# EAGLE schematic Master (EAGLE 6.5.0)
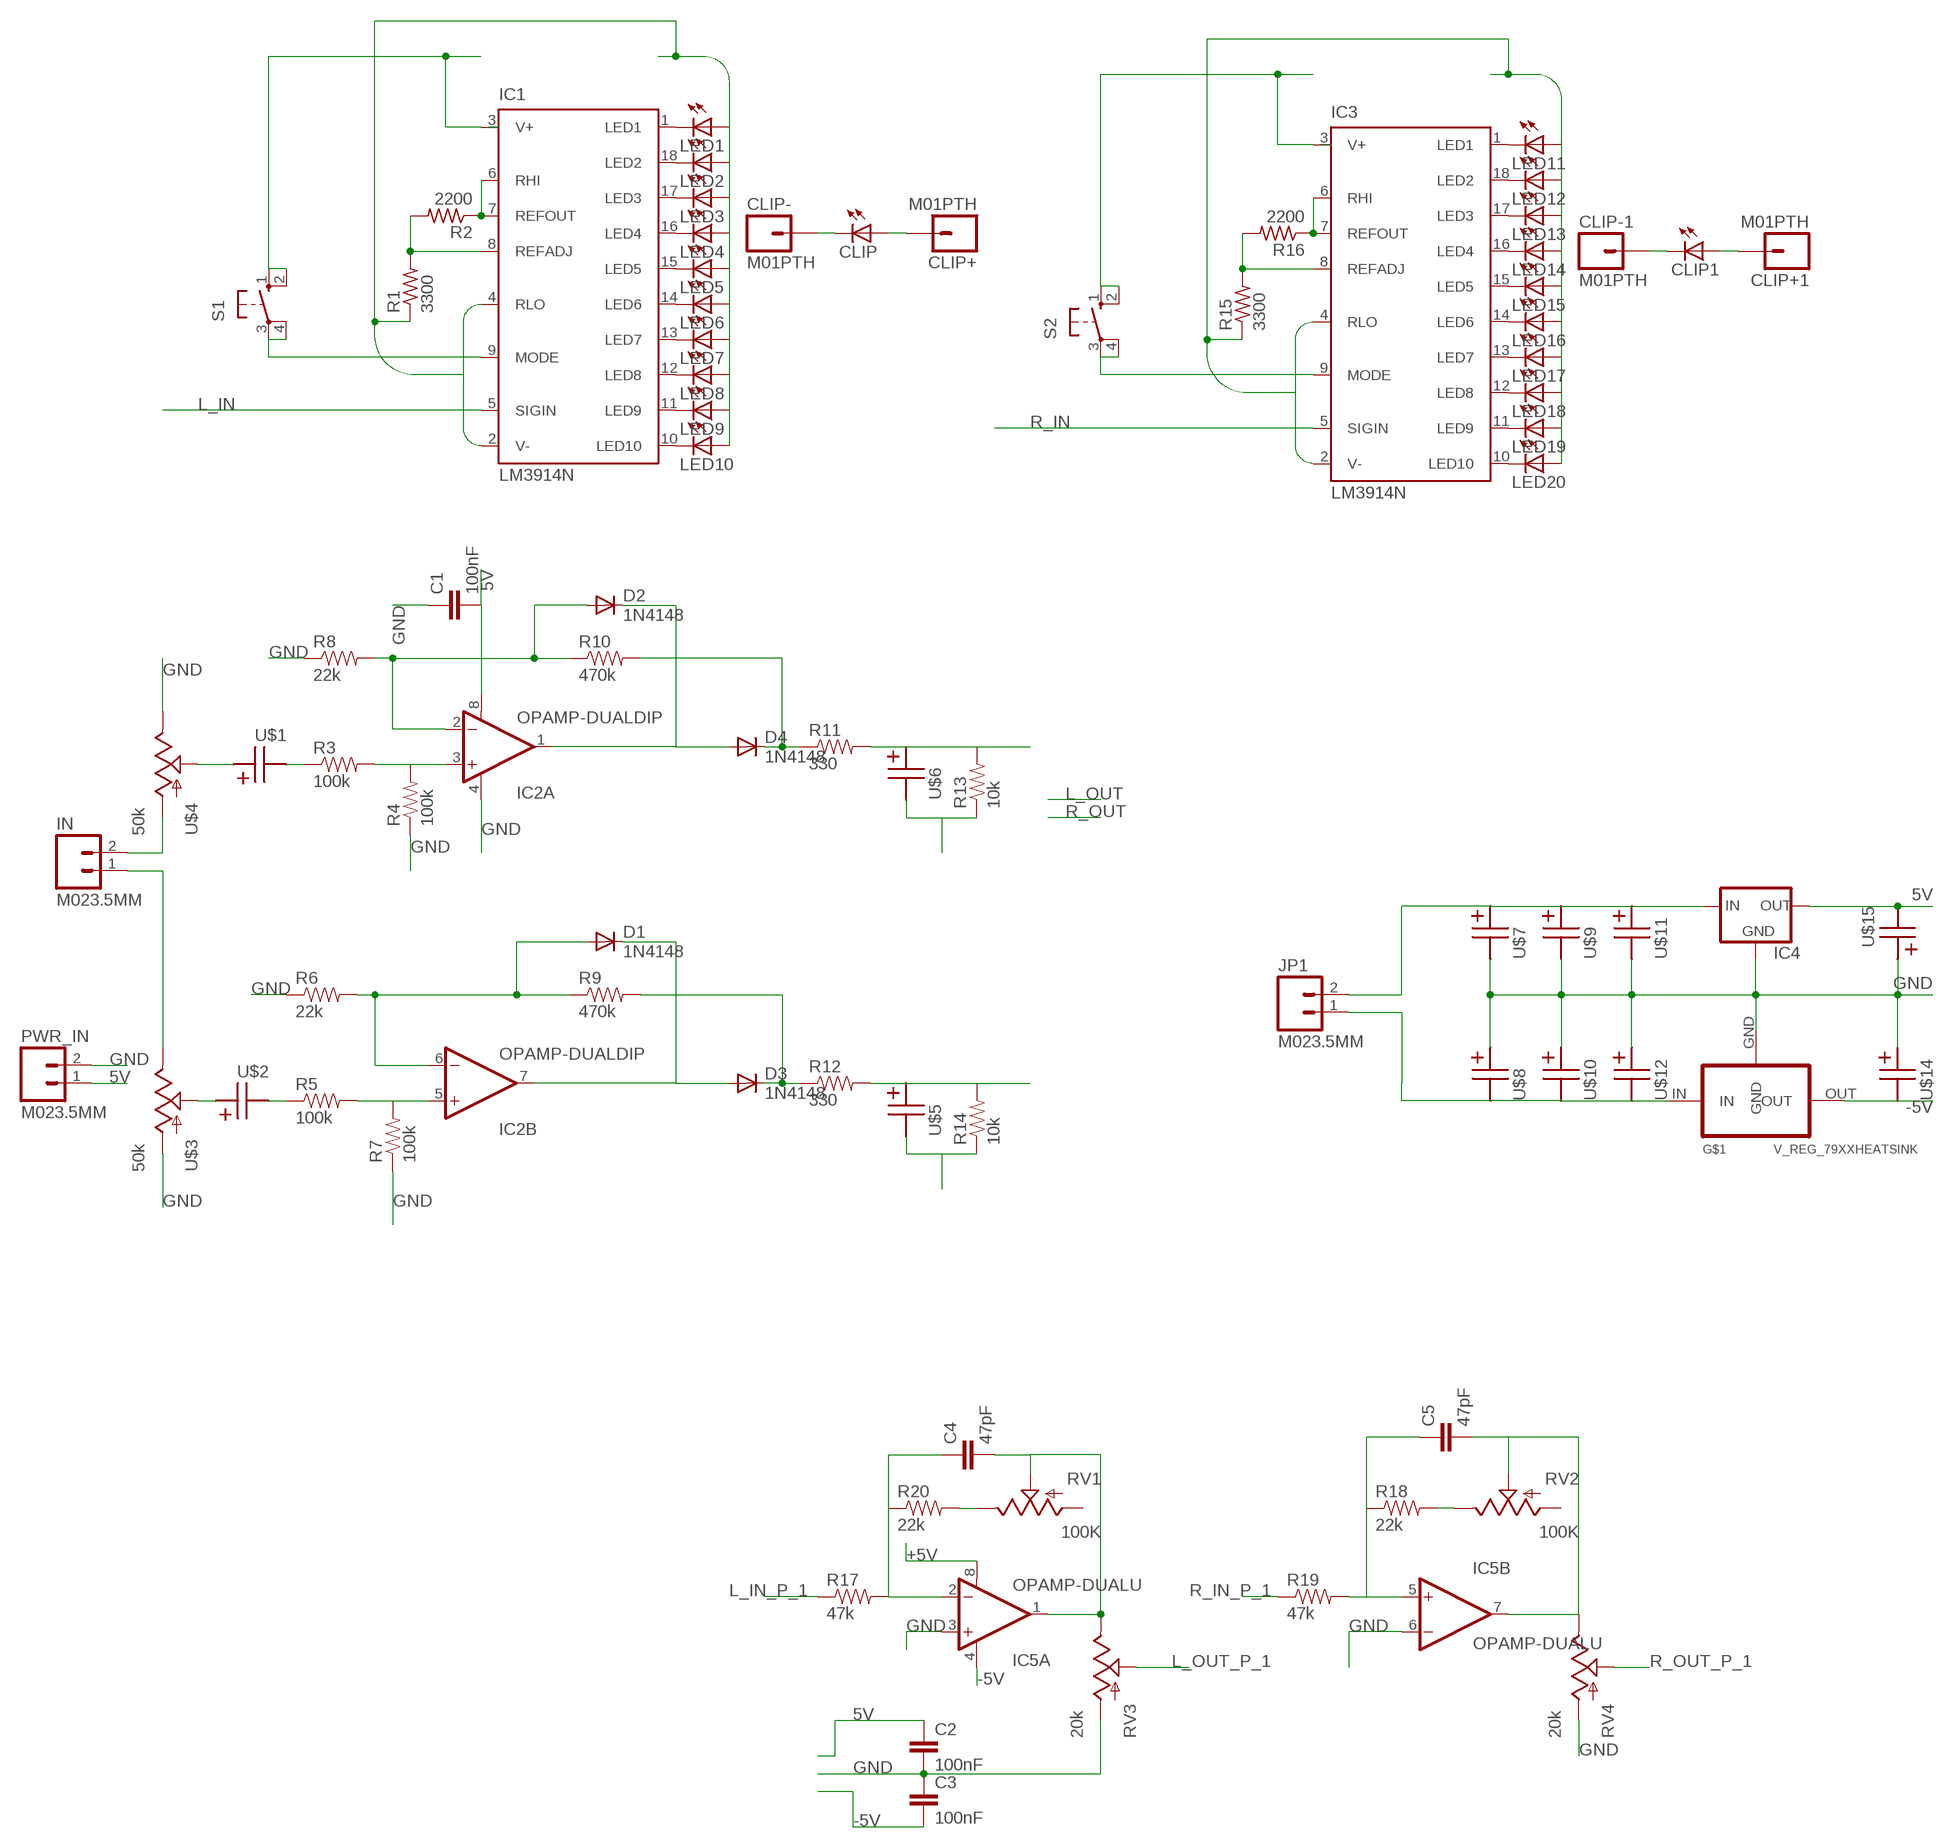
[diagram p0: schematic, sheet 1]

## Parts
C1  100nF  CAP0805  [0805]
C2  100nF  CAP1206  [1206]
C3  100nF  CAP1206  [1206]
C4  47pF  CAP0805  [0805]
C5  47pF  CAP0805  [0805]
CLIP  LED5MM  [LED5MM]
CLIP1  LED5MM  [LED5MM]
CLIP+  M01PTH  [1X01]
CLIP+1  M01PTH  [1X01]
CLIP-  M01PTH  [1X01]
CLIP-1  M01PTH  [1X01]
D1  1N4148  DIODE1N4148  [DIODE-1N4148]
D2  1N4148  DIODE1N4148  [DIODE-1N4148]
D3  1N4148  DIODE1N4148  [DIODE-1N4148]
D4  1N4148  DIODE1N4148  [DIODE-1N4148]
IC1  LM3914N  [DIL18]
IC2  OPAMP-DUALDIP  [DIP08]
IC3  LM3914N  [DIL18]
IC4  V_REG_78XXSINK  [TO220-IGO]
IC5  OPAMP-DUALU  [SO08]
IN  M023.5MM  [SCREWTERMINAL-3.5MM-2]
JP1  M023.5MM  [SCREWTERMINAL-3.5MM-2]
LED1  LED5MM  [LED5MM]
LED2  LED5MM  [LED5MM]
LED3  LED5MM  [LED5MM]
LED4  LED5MM  [LED5MM]
LED5  LED5MM  [LED5MM]
LED6  LED5MM  [LED5MM]
LED7  LED5MM  [LED5MM]
LED8  LED5MM  [LED5MM]
LED9  LED5MM  [LED5MM]
LED10  LED5MM  [LED5MM]
LED11  LED5MM  [LED5MM]
LED12  LED5MM  [LED5MM]
LED13  LED5MM  [LED5MM]
LED14  LED5MM  [LED5MM]
LED15  LED5MM  [LED5MM]
LED16  LED5MM  [LED5MM]
LED17  LED5MM  [LED5MM]
LED18  LED5MM  [LED5MM]
LED19  LED5MM  [LED5MM]
LED20  LED5MM  [LED5MM]
PWR_IN  M023.5MM  [SCREWTERMINAL-3.5MM-2]
R1  3300  R-US_0204/5  [0204/5]
R2  2200  R-US_0204/5  [0204/5]
R3  100k  RESISTORPTH-1/4W  [AXIAL-0.4]
R4  100k  RESISTORPTH-1/4W  [AXIAL-0.4]
R5  100k  RESISTORPTH-1/4W  [AXIAL-0.4]
R6  22k  RESISTORPTH-1/4W  [AXIAL-0.4]
R7  100k  RESISTORPTH-1/4W  [AXIAL-0.4]
R8  22k  RESISTORPTH-1/4W  [AXIAL-0.4]
R9  470k  RESISTORPTH-1/4W  [AXIAL-0.4]
R10  470k  RESISTORPTH-1/4W  [AXIAL-0.4]
R11  330  RESISTORPTH-1/4W  [AXIAL-0.4]
R12  330  RESISTORPTH-1/4W  [AXIAL-0.4]
R13  10k  RESISTORPTH-1/4W  [AXIAL-0.4]
R14  10k  RESISTORPTH-1/4W  [AXIAL-0.4]
R15  3300  R-US_0204/5  [0204/5]
R16  2200  R-US_0204/5  [0204/5]
R17  47k  RESISTORPTH-1/4W  [AXIAL-0.4]
R18  22k  RESISTORPTH-1/4W  [AXIAL-0.4]
R19  47k  RESISTORPTH-1/4W  [AXIAL-0.4]
R20  22k  RESISTORPTH-1/4W  [AXIAL-0.4]
RV1  100K  POTTRIM  [TRIM_POT]
RV2  100K  POTTRIM  [TRIM_POT]
RV3  20k  POT  [ALPS_POT]
RV4  20k  POT  [ALPS_POT]
S1  10-XX  [B3F-10XX]
S2  10-XX  [B3F-10XX]
U$1  6.8uF  5MM-12.5MM-POLAR2MMX5MM  [2MMLEAD_5MMDIAMETER]
U$2  6.8uF  5MM-12.5MM-POLAR2MMX5MM  [2MMLEAD_5MMDIAMETER]
U$3  50k  POT  [ALPS_POT]
U$4  50k  POT  [ALPS_POT]
U$5  2.2uF  5MM-12.5MM-POLAR2MMX5MM  [2MMLEAD_5MMDIAMETER]
U$6  2.2uF  5MM-12.5MM-POLAR2MMX5MM  [2MMLEAD_5MMDIAMETER]
U$7  5MM-12.5MM-POLAR5MMX12.5MM  [5MMLEAD_12.5MMDIAMETER]
U$8  5MM-12.5MM-POLAR5MMX12.5MM  [5MMLEAD_12.5MMDIAMETER]
U$9  5MM-12.5MM-POLAR5MMX12.5MM  [5MMLEAD_12.5MMDIAMETER]
U$10  5MM-12.5MM-POLAR5MMX12.5MM  [5MMLEAD_12.5MMDIAMETER]
U$11  5MM-12.5MM-POLAR5MMX12.5MM  [5MMLEAD_12.5MMDIAMETER]
U$12  5MM-12.5MM-POLAR5MMX12.5MM  [5MMLEAD_12.5MMDIAMETER]
U$13  V_REG_79XXHEATSINK  [TO220-IGO]
U$14  5MM-12.5MM-POLAR2MMX5MM  [2MMLEAD_5MMDIAMETER]
U$15  5MM-12.5MM-POLAR2MMX5MM  [2MMLEAD_5MMDIAMETER]

## Nets
5V: C1.2 C2.1 IC1.3(V+) IC2.8(A:V+) IC3.3(V+) IC4.OUT PWR_IN.1 S1.1(S) S1.2(S1) S2.1(S) S2.2(S1) U$15.+(-)
+5V: IC5.8(A:V+)
-5V: C3.2 IC5.4(A:V-) U$13.OUT U$14.+(-)
GND: C1.1 C2.2 C3.1 IC1.2(V-) IC1.4(RLO) IC2.4(A:V-) IC3.2(V-) IC3.4(RLO) IC4.GND IC5.3(A:+IN) IC5.6(B:-IN) LED1.A LED2.A LED3.A LED4.A LED5.A LED6.A LED7.A LED8.A LED9.A LED10.A LED11.A LED12.A LED13.A LED14.A LED15.A LED16.A LED17.A LED18.A LED19.A LED20.A PWR_IN.2 R1.1 R4.P$1 R6.P$1 R7.P$1 R8.P$1 R13.P$1 R14.P$1 R15.1 RV3.P$3(A) RV4.P$3(A) U$3.P$3(A) U$4.P$1(E) U$5.+(-) U$6.+(-) U$7.+(-) U$8.-(+) U$9.+(-) U$10.-(+) U$11.+(-) U$12.-(+) U$13.GND U$14.-(+) U$15.-(+)
L_IN: IC1.5(SIGIN) IN.2 U$4.P$3(A)
L_IN_P_1: R17.P$1
L_OUT: R11.P$2 R13.P$2 U$6.-(+)
L_OUT_P_1: RV3.P$2(S)
N$1: IC1.1(LED1) LED1.K(C)
N$2: IC1.6(RHI) IC1.7(REFOUT) R2.1
N$3: IC1.18(LED2) LED2.K(C)
N$4: IC1.17(LED3) LED3.K(C)
N$5: IC1.16(LED4) LED4.K(C)
N$6: IC1.15(LED5) LED5.K(C)
N$7: IC1.14(LED6) LED6.K(C)
N$8: IC1.13(LED7) LED7.K(C)
N$9: IC1.12(LED8) LED8.K(C)
N$10: IC1.11(LED9) LED9.K(C)
N$11: IC1.10(LED10) LED10.K(C)
N$12: R20.P$2 RV1.2(E)
N$13: IC1.8(REFADJ) R1.2 R2.2
N$14: D1.A IC2.6(B:-IN) R6.P$2 R9.P$1
N$15: IC1.9(MODE) S1.3(P) S1.4(P1)
N$16: C4.1 IC5.2(A:-IN) R17.P$2 R20.P$1
N$17: CLIP+.1 CLIP.A
N$18: CLIP-.1 CLIP.K(C)
N$19: D2.A IC2.2(A:-IN) R8.P$2 R10.P$1
N$20: IC2.5(B:+IN) R5.P$2 R7.P$2
N$21: IC2.3(A:+IN) R3.P$2 R4.P$2
N$23: D1.C D3.A IC2.7(B:OUT)
N$24: D3.C R9.P$2 R12.P$1
N$25: D4.C R10.P$2 R11.P$1
N$26: D2.C D4.A IC2.1(A:OUT)
N$27: R3.P$1 U$1.+(-)
N$28: R5.P$1 U$2.+(-)
N$29: U$2.-(+) U$3.P$2(S)
N$30: U$1.-(+) U$4.P$2(S)
N$32: IC3.6(RHI) IC3.7(REFOUT) R16.1
N$33: IC3.1(LED1) LED11.K(C)
N$34: IC3.18(LED2) LED12.K(C)
N$35: IC3.17(LED3) LED13.K(C)
N$36: IC3.16(LED4) LED14.K(C)
N$37: IC3.15(LED5) LED15.K(C)
N$38: IC3.14(LED6) LED16.K(C)
N$39: IC3.13(LED7) LED17.K(C)
N$40: IC3.12(LED8) LED18.K(C)
N$41: IC3.11(LED9) LED19.K(C)
N$42: IC3.10(LED10) LED20.K(C)
N$43: IC3.8(REFADJ) R15.2 R16.2
N$44: C4.2 IC5.1(A:OUT) RV1.1(S) RV3.P$1(E)
N$45: IC3.9(MODE) S2.3(P) S2.4(P1)
N$46: R18.P$2 RV2.2(E)
N$47: CLIP1.A CLIP+1.1
N$48: CLIP1.K(C) CLIP-1.1
N$49: C5.2 IC5.7(B:OUT) RV2.1(S) RV4.P$1(E)
N$50: C5.1 IC5.5(B:+IN) R18.P$1 R19.P$2
R_IN: IC3.5(SIGIN) IN.1 U$3.P$1(E)
R_IN_P_1: R19.P$1
R_OUT: R12.P$2 R14.P$2 U$5.-(+)
R_OUT_P_1: RV4.P$2(S)
RAW+: IC4.IN JP1.2 U$7.-(+) U$9.-(+) U$11.-(+)
RAW-: JP1.1 U$8.+(-) U$10.+(-) U$12.+(-) U$13.IN
Unconnected: RV1.3(A) RV2.3(A)

## Library data of the parts
C1-C5 = SparkFun-Passives:CAP: Capacitor Standard 0603 ceramic capacitor, and 0.1" leaded capacitor.
CLIP CLIP1 LED1-LED20 = led:LED: LED OSRAM: - CHIPLED LG R971, LG N971, LY N971, LG Q971, LY Q971, LO R971, LY R971 LH N974, LH R974 LS Q976, LO Q976, LY Q976 LO Q996 - Hyper CHIPLED LW Q18S LB Q993, LB Q99A, LB R99A - SideLED LS A670, LO A670, LY A670, LG A670, LP A670 LB A673, LV A673, LT A673, LW A673 LH A674 LY A675 LS A676, LA A676, LO A676, LY A676, LW A676 LS A679, LY A679, LG A679 - Hyper Micro SIDELED® LS Y876, LA Y876, LO Y876, LY Y876 LT Y87S - SmartLED LW L88C, LW L88S LB L89C, LB L89S, LG L890 LS L89K, LO L89K, LY L89K LS L896, LA L896, LO L896, LY L896 - TOPLED LS T670, LO T670, LY T670, LG T670, LP T670 LSG T670, LSP T670, LSY T670, LOP T670, LYG T670 LG T671, LOG T671, LSG T671 LB T673, LV T673, LT T673, LW T673 LH T674 LS T676, LA T676, LO T676, LY T676, LB T676, LH T676, LSB T676, LW T676 LB T67C, LV T67C, LT T67C, LS T67K, LO T67K, LY T67K, LW E67C LS E67B, LA E67B, LO E67B, LY E67B, LB E67C, LV E67C, LT E67C LW T67C LS T679, LY T679, LG T679 LS T770, LO T770, LY T770, LG T770, LP T770 LB T773, LV T773, LT T773, LW T773 LH T774 LS E675, LA E675, LY E675, LS T675 LS T776, LA T776, LO T776, LY T776, LB T776 LHGB T686 LT T68C, LB T68C - Hyper Mini TOPLED® LB M676 - Mini TOPLED Santana® LG M470 LS M47K, LO M47K, LY M47K Source: http://www.osram.convergy.de LUXEON: - LUMILED® LXK2-PW12-R00, LXK2-PW12-S00, LXK2-PW14-U00, LXK2-PW14-V00 LXK2-PM12-R00, LXK2-PM12-S00, LXK2-PM14-U00 LXK2-PE12-Q00, LXK2-PE12-R00, LXK2-PE12-S00, LXK2-PE14-T00, LXK2-PE14-U00 LXK2-PB12-K00, LXK2-PB12-L00, LXK2-PB12-M00, LXK2-PB14-N00, LXK2-PB14-P00, LXK2-PB14-Q00 LXK2-PR12-L00, LXK2-PR12-M00, LXK2-PR14-Q00, LXK2-PR14-R00 LXK2-PD12-Q00, LXK2-PD12-R00, LXK2-PD12-S00 LXK2-PH12-R00, LXK2-PH12-S00 LXK2-PL12-P00, LXK2-PL12-Q00, LXK2-PL12-R00 Source: www.luxeon.com KINGBRIGHT: KA-3528ASYC Source: www.kingbright.com
CLIP+ CLIP+1 CLIP- CLIP-1 = SparkFun-Connectors:M01: Header 1 Standard 1-pin 0.1" header. Use with straight break away headers (SKU : PRT-00116), right angle break away headers (PRT-00553), swiss pins (PRT-00743), machine pins (PRT-00117), and female headers (PRT-00115).
D1-D4 = SparkFun-DiscreteSemi:DIODE: Diode These are standard reverse protection diodes and small signal diodes. SMA package can handle up to about 1A. SOD-323 can handle about 200mA. What the SOD-323 package when ordering, there are some mfgs out there that are 5-pin packages.
IC1 IC3 = national-semiconductor:LM391: Dot/Bar Display Driver Source: Data sheet LM3915 <http://www.national.com/ds/LM/LM3915.pdf> Data sheet LM3914 <http://www.national.com/ds/LM/LM3914.pdf>
IC2 IC5 = SparkFun-AnalogIC:OPAMP-DUAL: Generic op-amp footprint
IC4 = AMP Library:V_REG_78XX: Voltage Regulator Standard 7805 5V regulator. IGO (Input Ground Output). Spark Fun Electronics SKU : COM-00107
IN JP1 PWR_IN = SparkFun-Connectors:M02: Standard 2-pin 0.1" header. Use with - straight break away headers ( PRT-00116) - right angle break away headers (PRT-00553) - swiss pins (PRT-00743) - machine pins (PRT-00117) - female headers (PRT-00115) Molex polarized connector foot print use with: PRT-08233 with associated crimp pins and housings. 2.54_SCREWTERM for use with PRT-10571. 3.5mm Screw Terminal footprints for PRT-08084 5mm Screw Terminal footprints for use with PRT-08433
R1 R2 R15 R16 = resistor:R-US_: RESISTOR, American symbol
R3-R14 = SparkFun-Resistors:RESISTOR: Resistor Basic schematic elements and footprints for 0603, 1206, and PTH resistors.
R17-R20 = SparkFun-Passives:RESISTOR: Resistor Basic schematic elements and footprints for 0603, 1206, and PTH resistors.
RV1-RV4 U$3 U$4 = SparkFun-Electromechanical:POT
S1 S2 = switch-omron:10-XX: OMRON SWITCH; MPN: B3F-1000; OC_FARNELL: 176432; OC_NEWARK: 36M3542
U$1 U$2 U$5-U$12 U$14 U$15 = AMP Library:5MM-12.5MM-POLAR
U$13 = AMP Library:V_REG_79XX